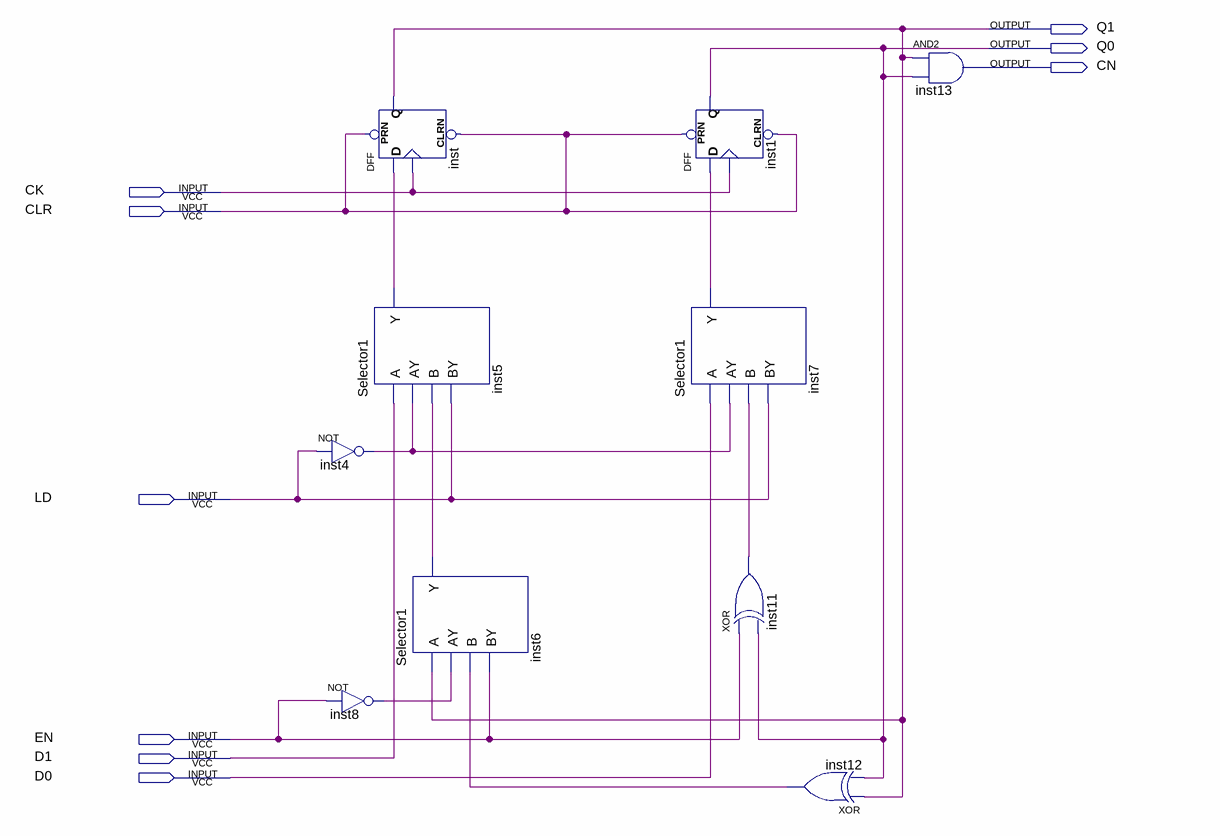
[diagram p0: schematic sheet]
// Quartus schematic Scounter2.bdf as structural Verilog: 10 symbols, 9 pins
module Scounter2 (
  input  CK,
  input  CLR,
  input  LD,
  input  EN,
  input  D1,
  input  D0,
  output Q1,
  output Q0,
  output CN
);

  wire inst4_out, inst5_y, inst6_y, inst7_y, inst8_out, inst11_out, inst12_out;

  Selector1 inst5 (.A(D1), .AY(inst4_out), .B(inst6_y), .BY(LD), .Y(inst5_y));
  not inst4 (inst4_out, LD);
  not inst8 (inst8_out, EN);
  DFF inst (.CLRN(CLR), .CLK(CK), .D(inst5_y), .PRN(CLR), .Q(Q1));
  Selector1 inst6 (.A(Q1), .AY(inst8_out), .B(inst12_out), .BY(EN), .Y(inst6_y));
  DFF inst1 (.CLRN(CLR), .CLK(CK), .D(inst7_y), .PRN(CLR), .Q(Q0));
  Selector1 inst7 (.A(D0), .AY(inst4_out), .B(inst11_out), .BY(LD), .Y(inst7_y));
  xor inst11 (inst11_out, EN, Q0);
  xor inst12 (inst12_out, Q1, Q0);
  and inst13 (CN, Q1, Q0);
endmodule
